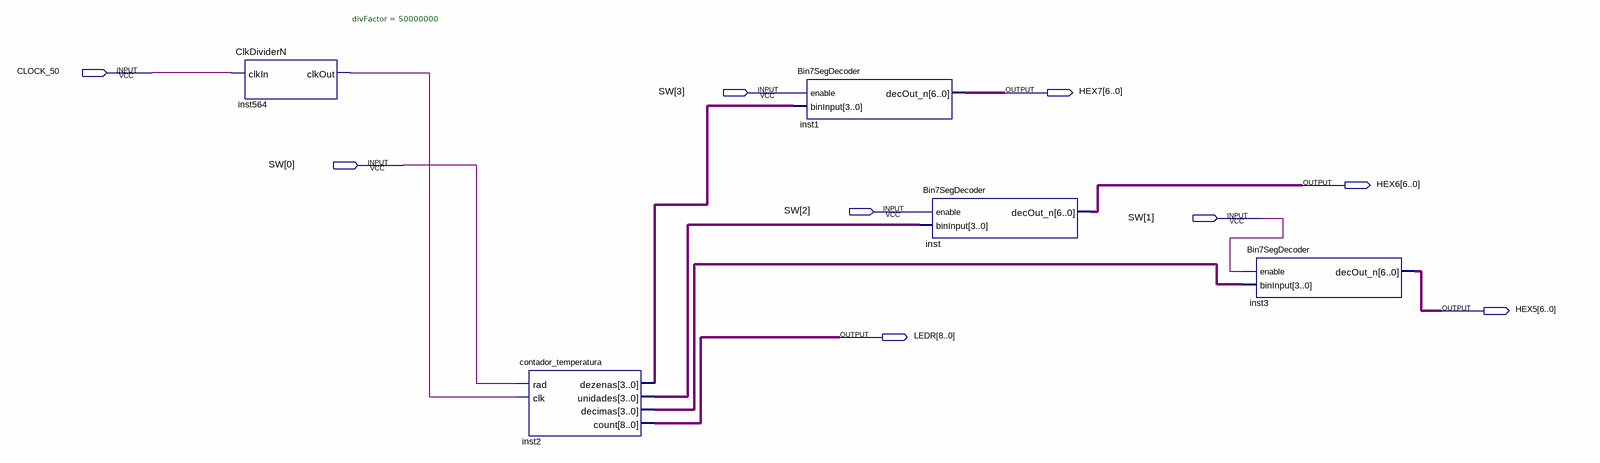
[diagram p0: schematic sheet]
// Quartus schematic teste_clock.bdf as structural Verilog: 5 symbols, 9 pins
module teste_clock (
  input  CLOCK_50,
  input  [3:0] SW,
  output [6:0] HEX7,
  output [6:0] HEX6,
  output [6:0] HEX5,
  output [8:0] LEDR
);

  wire inst564_clkout;
  wire [3:0] inst2_decimas, inst2_dezenas, inst2_unidades;

  ClkDividerN #(.divFactor(50000000)) inst564 (.clkIn(CLOCK_50), .clkOut(inst564_clkout));
  contador_temperatura inst2 (
    .rad(SW[0]), .clk(inst564_clkout), .dezenas(inst2_dezenas), .unidades(inst2_unidades),
    .decimas(inst2_decimas), .count(LEDR));
  Bin7SegDecoder inst1 (.enable(SW[3]), .binInput(inst2_dezenas), .decOut_n(HEX7));
  Bin7SegDecoder inst (.enable(SW[2]), .binInput(inst2_unidades), .decOut_n(HEX6));
  Bin7SegDecoder inst3 (.enable(SW[1]), .binInput(inst2_decimas), .decOut_n(HEX5));
endmodule
